# Altium schematic sheet testSheet.SchDoc
size A4
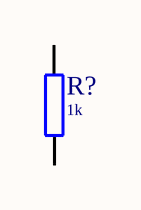
[diagram p0: testSheet.SchDoc]

## Parts
R?  1k  [R0805]

## Nets

Not connected (* = marked no-connect by the designer): R? 1 2

## Library data of the parts
R? = R-0805: SMD 0805 0.1W 5% 150V; Price: 0.017; Value: 1k